# EAGLE design IR_Transmitter (EAGLE 9.6.2)
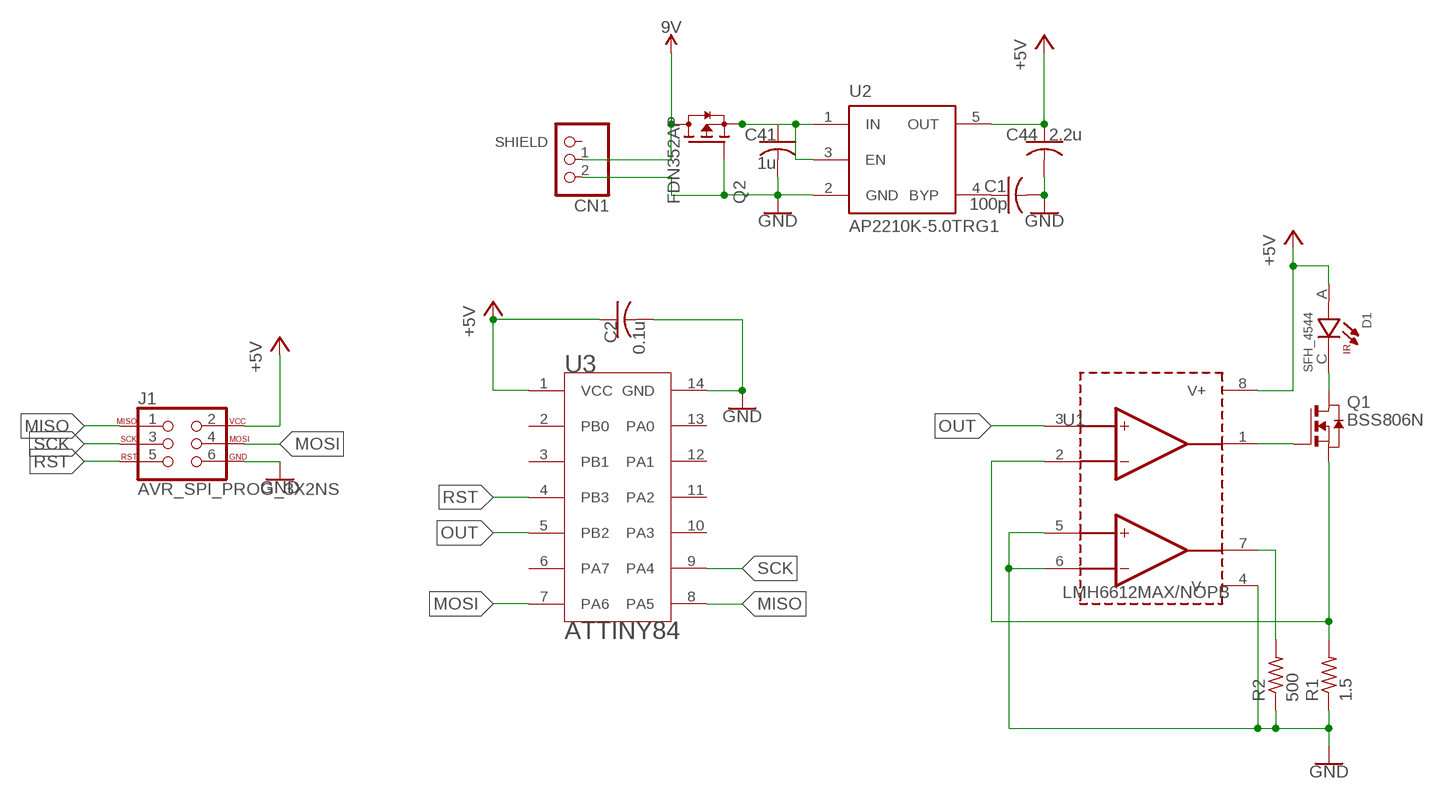
[diagram p0: schematic, sheet 1]

## Parts
C1  100p  C-USC0603  [C0603]
C2  0.1u  C-USC0603  [C0603]
C41  1u  C-USC0603  [C0603]
C44  2.2u  C-USC0603  [C0603]
CN1  JST_2PIN-SMT-RA  [JST-PH-2-SMT-RA]
D1  SFH_4544  [DIO_SFH_4544]
J1  AVR_SPI_PROG_3X2NS  [2X3-NS]
Q1  BSS806N  [SOT-23-3]
Q2  FDN352AP  [SSOT-3]
R1  1.5  R-US_R0805  [R0805]
R2  500  R-US_R0603  [R0603]
U1  LMH6612MAX/NOPB  [8-SOIC]
U2  AP2210K-5.0TRG1  [SOT-23-5]
U3  ATTINY84  [SOIC-14]

## Nets
9V: CN1.1 Q2.3(D)
+5V: C2.1 C44.1 D1.A J1.2 U1.8(V+) U2.5(OUT) U3.1(VCC)
GND: C1.2 C2.2 C41.2 C44.2 CN1.2 J1.6 Q2.1(G) R1.1 R2.1 U1.4(V-) U1.5(INB+) U1.6(INB-) U2.2(GND) U3.14(GND)
MISO: J1.1 U3.8(PA5)
MOSI: J1.4 U3.7(PA6)
N$1: Q1.2(S) R1.2 U1.2(INA-)
N$2: Q1.1(G) U1.1(OUTA)
N$3: R2.2 U1.7(OUTB)
N$5: D1.C Q1.3(D)
N$6: C1.1 U2.4(BYP)
N$7: C41.1 Q2.2(S) U2.1(IN) U2.3(EN)
OUT: U1.3(INA+) U3.5(PB2)
RST: J1.5 U3.4(PB3)
SCK: J1.3 U3.9(PA4)
Unconnected: CN1.NC1(SHIELD) CN1.NC2(SHIELD) U3.2(PB0) U3.3(PB1) U3.6(PA7) U3.10(PA3) U3.11(PA2) U3.12(PA1) U3.13(PA0)

## Library data of the parts
C1 C2 C41 C44 = rcl:C-US: CAPACITOR, American symbol; SPICEPREFIX: C
CN1 = Hocki_Library:JST_2PIN: JST 2-Pin Connectors of various flavors SMT-RA (S2B-PH-SM4) 4UConnector #17311 SMT (B2B-PH-SM4) THM-RA (S2B-PH) THM (B2B-PH)
D1 = EmitterParts:SFH_4544: Infrared (IR) Emitter 940nm 1.6V 100mA 550mW/sr @ 100mA 20° Radial DigiKey <https://www.digikey.com/product-detail/en/osram-opto-semiconductors-inc/SFH-4544/475-3524-ND/5231484>; DKPN: 475-3524-ND
J1 = SparkFun-Connectors:AVR_SPI_PROG_3X2: AVR ISP 6 Pin This is the reduced ISP connector for AVR programming. Common on Arduino. This footprint will take up less PCB space and can be used with a 10-pin to 6-pin adapter such as SKU: BOB-08508 **Special note about "TEST_POINT" package. The stop mask is on the top side, so if you want your programming test points to be on the bottom of your board, make sure to place this package on the bottom side of the board. This also ensure that the orientation to program from the bottom side will be correct. SparkFun Products: SparkFun ISP Pogo Adapter <https://www.sparkfun.com/products/11591> - NS Tiny AVR Programmer <https://www.sparkfun.com/products/11801> -PTH
Q1 = RoboJackets-Discrete:BSS806N; DKPN: BSS806NH6327XTSA1CT-ND
Q2 = EmitterParts:FDN352AP
R1 R2 = rcl:R-US_: RESISTOR, American symbol; SPICEPREFIX: R
U1 = Hocki_Library:LMH6612MAX/NOPB: General Purpose Amplifier 2 Circuit Rail-to-Rail 8-SOIC DigiKey <https://www.digikey.com/product-detail/en/texas-instruments/LMH6612MAX-NOPB/296-46310-1-ND/7033484>; DKPN: 296-46310-1-ND
U2 = Hocki_Library:AP2210K-*TRG1: Linear Voltage Regulator IC 1 Output 300mA SOT-23-5 3.3V DigiKey <https://www.digikey.com/product-detail/en/diodes-incorporated/AP2210K-3-3TRG1/AP2210K-3-3TRG1DICT-ND/4505291> 5.0V DigiKey <https://www.digikey.com/product-detail/en/diodes-incorporated/AP2210K-5-0TRG1/AP2210K-5-0TRG1DICT-ND/4505292>; DKPN: AP2210K-5.0TRG1DICT-ND
U3 = EmitterParts:ATTINY84: AVR AVR® ATtiny Microcontroller IC 8-Bit 16MHz 8KB (8K x 8) FLASH 14-SOIC DigiKey <https://www.digikey.com/product-detail/en/microchip-technology/ATTINY841-SSUR/ATTINY841-SSURCT-ND/4437442>; DKPN: ATTINY841-SSURCT-ND

## Board
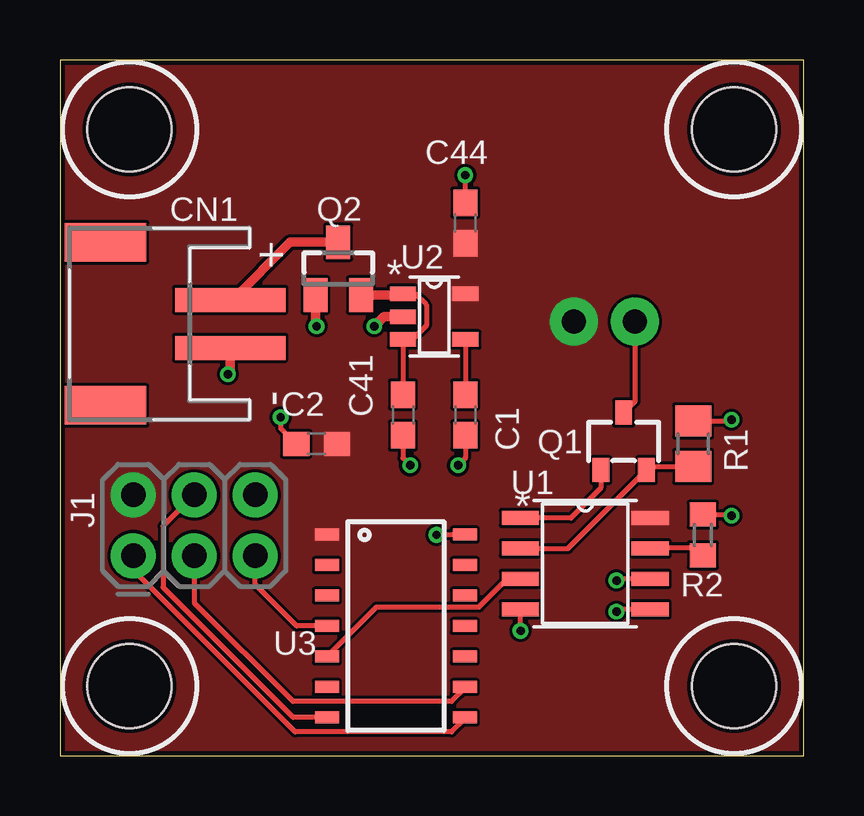
[diagram p1: board, top side]
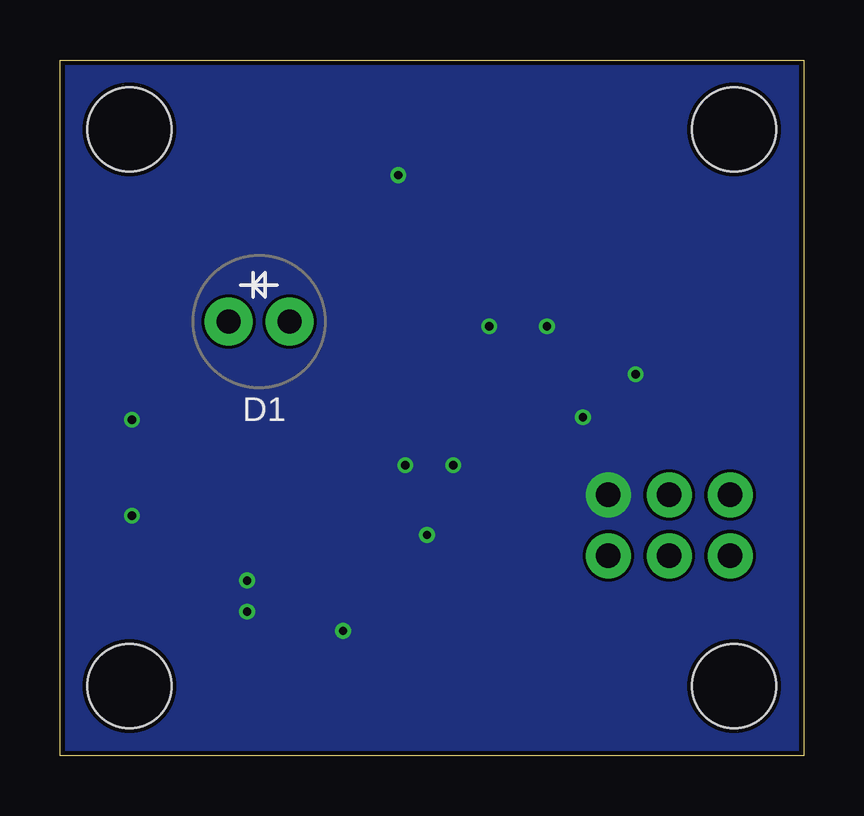
[diagram p2: board, bottom side, seen from below]

Size 31 x 29 mm. Coordinates in mm from the lower left corner, seen from the top.
Outline: 0,0 31,0 31,29 0,29 0,0
Copper layers (1+16): Top 0.035mm / dielectric 1.53mm / Bottom 0.035mm
Design rules "JLCPCB (2 Layer)": minimum track width 5mil, minimum drill 0.3mm, track to track 5mil, track to pad 5mil, pad to pad 5mil, via to via 20mil, smd to smd 5mil, copper to edge 0.2mm, drill to drill 21mil, minimum pad ring 6mil, minimum via ring 6mil, stop-mask expansion 6mil, vias tented up to drill 30mil, thermal gap 10mil
Holes 3.5 mm at 2.9,2.9 28.1,2.9 2.9,26.1 28.1,26.1

### Footprints (pad centres in the part's own frame; a part is rotated, then mirrored left to right if it is on the bottom)
C0603 = smd 1.1 x 1: 1 -0.85,0; 2 0.85,0
JST-PH-2-SMT-RA = smd 1 x 4.6: 1 1,-3.7; 2 -1,-3.7 | smd 1.6 x 3.4: NC1 -3.4,1.5; NC2 3.4,1.5
DIO_SFH_4544 = drill 1 pad 2: A 1.27,0; C -1.27,0
2X3-NS = drill 1.016 pad 1.88: 1 -2.54,-1.27; 2 -2.54,1.27; 3 0,-1.27; 4 0,1.27; 5 2.54,-1.27; 6 2.54,1.27
SOT-23-3 = smd 0.7 x 1: 1 -0.95,-1.2; 2 0.95,-1.2; 3 0,1.2
SSOT-3 = smd 1 x 1.4: 1 -0.95,-1.1; 2 0.95,-1.1; 3 0,1.1
R0805 = smd 1.3 x 1.5: 1 -0.95,0; 2 0.95,0
R0603 = smd 1 x 1.1: 1 -0.85,0; 2 0.85,0
8-SOIC = smd 1.55 x 0.6: 1 -2.7,1.905; 2 -2.7,0.635; 3 -2.7,-0.635; 4 -2.7,-1.905; 5 2.7,-1.905; 6 2.7,-0.635; 7 2.7,0.635; 8 2.7,1.905
SOT-23-5 = smd 1.1 x 0.6: 1 -1.3,0.95; 2 -1.3,0; 3 -1.3,-0.95; 4 1.3,-0.95; 5 1.3,0.95
SOIC-14 = smd 1 x 0.5: 1 -2.875,3.81; 2 -2.875,2.54; 3 -2.875,1.27; 4 -2.875,0; 5 -2.875,-1.27; 6 -2.875,-2.54; 7 -2.875,-3.81; 8 2.875,-3.81; 9 2.875,-2.54; 10 2.875,-1.27; 11 2.875,0; 12 2.875,1.27; 13 2.875,2.54; 14 2.875,3.81

### Placement (x,y rotation side)
C1  16.9,14.2 270 top
C2  10.7,13 180 top
C41  14.3,14.2 270 top
C44  16.9,22.2 90 top
CN1  3.4,18 90 top
D1  22.7,18.1 0 bottom
J1  5.6,9.6 0 top
Q1  23.5,13.1 0 top
Q2  11.6,20.3 0 top
R1  26.4,13 270 top
R2  26.8,9.2 270 top
U1  21.9,8 0 top
U2  15.6,18.3 0 top
U3  14,5.4 0 top

### Tracks (layer width: path | path; a pad name or v marks a point on that pad's centre or on a via)
9V
  Top 0.2: CN1.1 7.2,19
  Top 0.4: Q2.3 9.6,21.4 7.2,19
+5V
  pour Top (no thermals): 0,0 0,29 31,29 31,0
GND  (via drill 0.35)
  Top 0.2: C44.2 v16.9,24.2 | C41.2 14.3,12.4 v14.6,12.1 | C1.2 16.9,12.4 v16.6,12.1 | U3.14 16.86,9.2 v15.7,9.2 | v9.2,14.1 9.2,13.65 C2.2 | v19.2,5.2 U1.4 | R2.1 27.95,10.05 v28,10 | R1.1 27.95,13.95 v28,14 | U1.6 23.27,7.37 v23.2,7.3 | U1.5 23.3,6.09 v23.2,6
  Top 0.4: U2.2 13.5,18.3 v13.1,17.9 | Q2.1 10.65,17.95 v10.7,17.9 | CN1.2 7.1,16 v7,15.9
  pour Bottom (no thermals): 31,0 0,0 0,29 31,29
MISO
  Top 0.2: U3.8 16.88,1.53 16.33,0.99 9.8,0.99 3.06,7.73 J1.1
MOSI
  Top 0.2: U3.7 9.73,1.59 4.3,7.02 4.3,9.57 J1.4
N$1
  Top 0.2: U1.2 21.18,8.63 Q1.2 24.6,12.05 R1.2
N$2
  Top 0.2: Q1.1 22.55,11.15 21.3,9.9 U1.1
N$3
  Top 0.2: R2.2 26.5,8.65 24.52,8.65 24.59,8.65 U1.7
N$5
  Top 0.2: D1.C 23.97,14.77 Q1.3
N$6
  Top 0.2: U2.4 C1.1
N$7
  Top 0.2: C41.1 U2.3 14.7,17.35 15.28,17.93 15.28,18.79 14.82,19.25 U2.1 14.25,19.2
  Top 0.4: Q2.2 14.25,19.2
OUT
  Top 0.2: U1.3 18.64,7.37 17.47,6.19 13.19,6.19 U3.5
RST
  Top 0.2: U3.4 9.87,5.4 8.14,7.13 J1.5
SCK
  Top 0.2: U3.9 16.88,2.8 16.33,2.26 9.71,2.26 5.6,6.37 J1.3